# EAGLE schematic breakout (EAGLE 9.6.2)
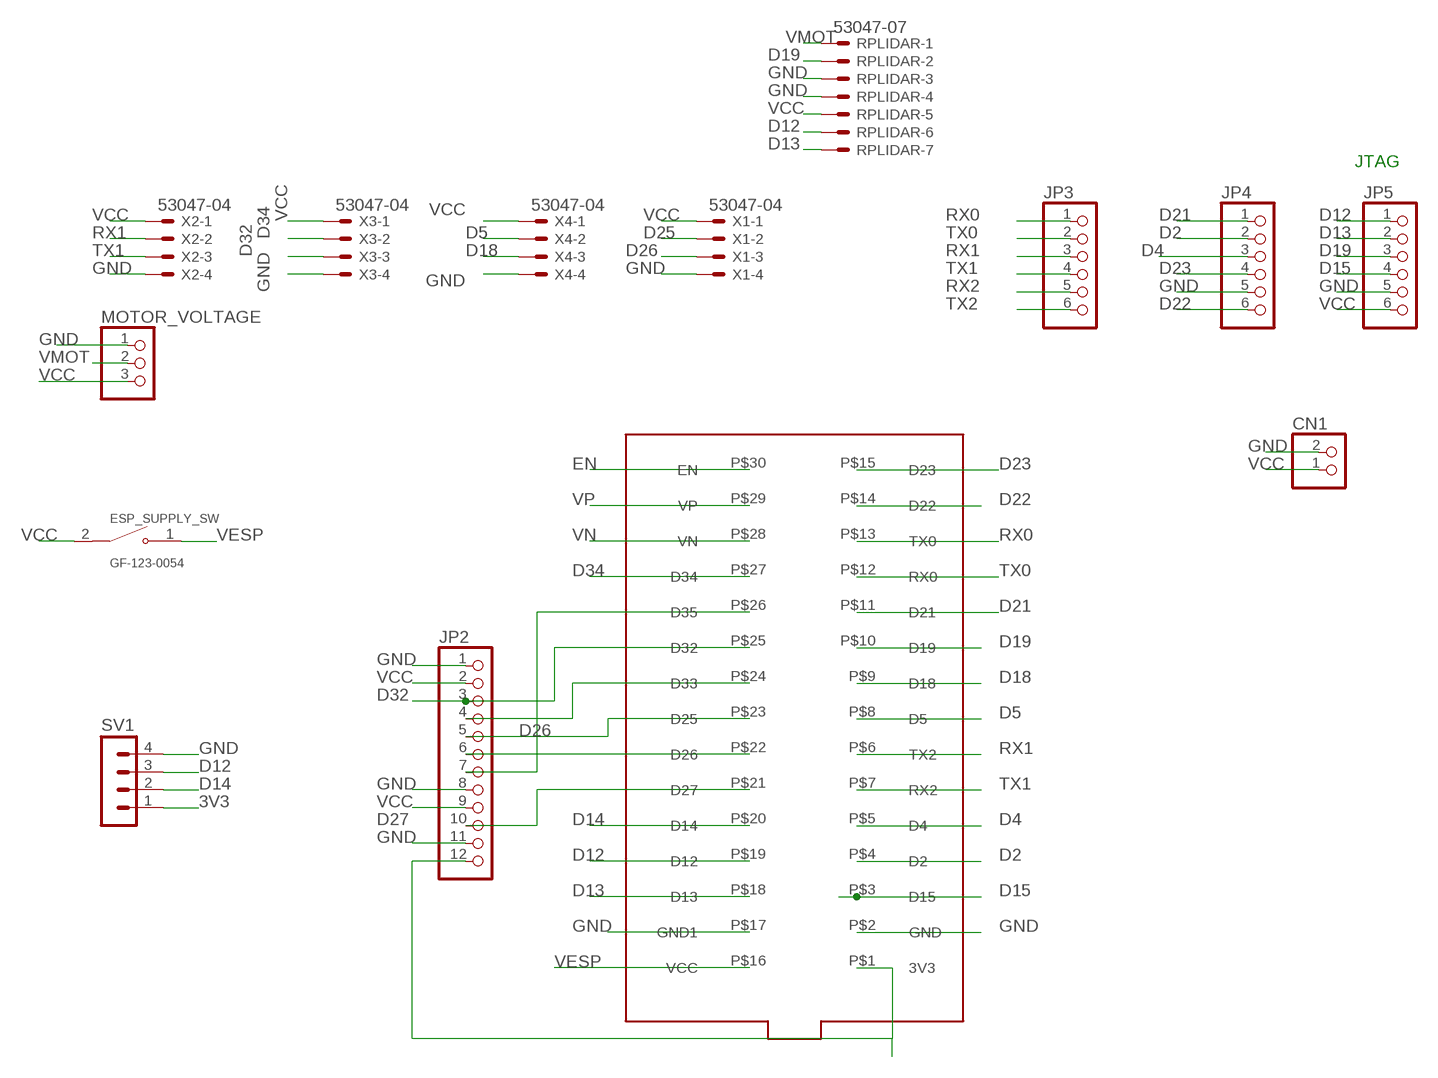
[diagram p0: schematic, sheet 1]

## Parts
CN1  JST_2PIN-THM  [JST-PH-2-THM]
ESP_SUPPLY_SW  GF-123-0054  [SW_GF-123-0054]
JP2  PINHD-1X12  [1X12]
JP3  PINHD-1X6  [1X06]
JP4  PINHD-1X6  [1X06]
JP5  PINHD-1X6  [1X06]
MOTOR_VOLTAGE  PINHD-1X3  [1X03]
RPLIDAR  53047-07  [53047-07]
SV1  MA04-1  [MA04-1]
U$1  ESP-32_30P_BKOUT  [ESP32-30P]
X1  53047-04  [53047-04]
X2  53047-04  [53047-04]
X3  53047-04  [53047-04]
X4  53047-04  [53047-04]

## Nets
3V3: SV1.1
D2: JP4.2 U$1.P$4(D2)
D4: JP4.3 U$1.P$5(D4)
D5: U$1.P$8(D5) X4.2
D12: JP5.1 RPLIDAR.6 SV1.3 U$1.P$19(D12)
D13: JP5.2 RPLIDAR.7 U$1.P$18(D13)
D14: SV1.2 U$1.P$20(D14)
D15: JP5.4 U$1.P$3(D15)
D18: U$1.P$9(D18) X4.3
D19: JP5.3 RPLIDAR.2 U$1.P$10(D19)
D21: JP4.1 U$1.P$11(D21)
D22: JP4.6 U$1.P$14(D22)
D23: JP4.4 U$1.P$15(D23)
D25: JP2.5 U$1.P$23(D25) X1.2
D26: JP2.6 U$1.P$22(D26) X1.3
D27: JP2.10 U$1.P$21(D27)
D32: JP2.3 U$1.P$25(D32) X3.3
D34: U$1.P$27(D34) X3.2
EN: U$1.P$30(EN)
GND: CN1.2 JP2.1 JP2.8 JP2.11 JP4.5 JP5.5 MOTOR_VOLTAGE.1 RPLIDAR.3 RPLIDAR.4 SV1.4 U$1.P$2(GND) U$1.P$17(GND1) X1.4 X2.4 X3.4 X4.4
N$1: JP2.12 U$1.P$1(3V3)
N$6: JP2.4 U$1.P$24(D33)
N$20: JP2.7 U$1.P$26(D35)
RX0: JP3.1 U$1.P$13(TX0)
RX1: JP3.3 U$1.P$6(TX2) X2.2
RX2: JP3.5
TX0: JP3.2 U$1.P$12(RX0)
TX1: JP3.4 U$1.P$7(RX2) X2.3
TX2: JP3.6
VCC: CN1.1 ESP_SUPPLY_SW.2 JP2.2 JP2.9 JP5.6 MOTOR_VOLTAGE.3 RPLIDAR.5 X1.1 X2.1 X3.1 X4.1
VESP: ESP_SUPPLY_SW.1 U$1.P$16(VCC)
VMOT: MOTOR_VOLTAGE.2 RPLIDAR.1
VN: U$1.P$28(VN)
VP: U$1.P$29(VP)

## Notes on the sheet
- JTAG

## Library data of the parts
CN1 = adafruit:JST_2PIN: JST 2-Pin Connectors of various flavors SMT-RA (S2B-PH-SM4) 4UConnector #17311 SMT (B2B-PH-SM4) THM-RA (S2B-PH) THM (B2B-PH)
ESP_SUPPLY_SW = GF-123-0054:GF-123-0054: Slide Switch SPST Through Hole Check availability <https://pricing.snapeda.com/parts/GF-123-0054/CW%20Industries/view-part?ref=eda>; AVAILABILITY: In Stock; DESCRIPTION: Slide Switch SPST Through Hole; MF: CW Industries; MP: GF-123-0054; PACKAGE: None; PRICE: None; PURCHASE-URL: https://pricing.snapeda.com/search/part/GF-123-0054/?ref=eda
JP2 = adafruit:PINHD-1X12: PIN HEADER
JP3-JP5 = adafruit:PINHD-1X6: PIN HEADER
MOTOR_VOLTAGE = adafruit:PINHD-1X3: PIN HEADER
RPLIDAR = con-molex:53?-07: CONNECTOR wire to board 1.25 mm (.049 inch) pitch header; MF: MOLEX; MPN: 53047-0710-C; OC_FARNELL: 9732870; OC_NEWARK: 11M0149
SV1 = con-lstb:MA04-1: PIN HEADER; OC_FARNELL: unknown; OC_NEWARK: unknown
U$1 = esp_custom:ESP-32_30P_BKOUT
X1-X4 = con-molex:53?-04: CONNECTOR wire to board 1.25 mm (.049 inch) pitch header; MF: WALDOM/MOLEX; MPN: 53047-0410; OC_FARNELL: 9733060; OC_NEWARK: 38C9900